# Altium schematic sheet [02] - SIM.SchDoc: =ProjectName
size A4; CheckedBy: DatNB; Author: Ven; CompanyName: Nacentech; Organization: IMET
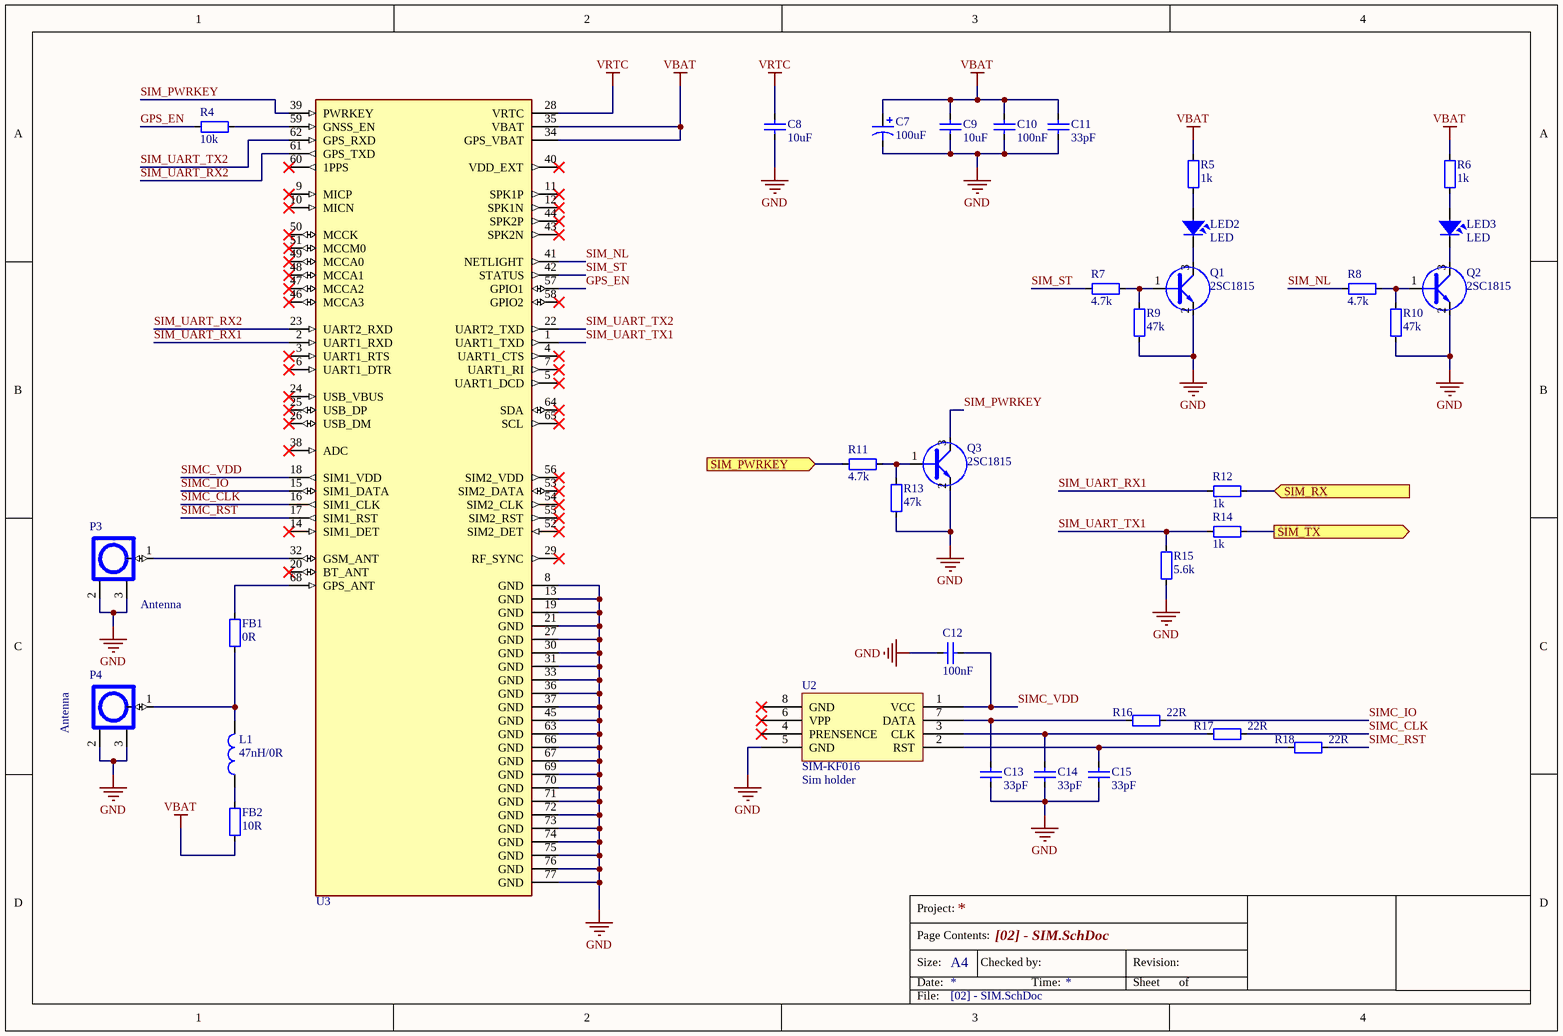
[diagram p0: [02] - SIM.SchDoc]

## Parts
C7  100uF  [CAP_7343]
C8  10uF  [CAP_0603]
C9  10uF  [CAP_0603]
C10  100nF  [CAP_0603]
C11  33pF  [CAP_0603]
C12  100nF  [CAP_0603]
C13  33pF  [CAP_0603]
C14  33pF  [CAP_0603]
C15  33pF  [CAP_0603]
FB1  0R  [RES-SMD-0805]
FB2  10R  [RES-SMD-0805]
L1  47nH/0R  [L-0805]
LED2  LED  [LED-0805-Yellow]
LED3  LED  [LED-1206-Blue]
P3  Antenna  [IPXS]
P4  Antenna  [IPXS]
Q1  2SC1815  [SOT23D]
Q2  2SC1815  [SOT23D]
Q3  2SC1815  [SOT23D]
R4  10k  [RES-SMD-0603]
R5  1k  [RES-SMD-0603]
R6  1k  [RES-SMD-0603]
R7  4.7k  [RES-SMD-0603]
R8  4.7k  [RES-SMD-0603]
R9  47k  [RES-SMD-0603]
R10  47k  [RES-SMD-0603]
R11  4.7k  [RES-SMD-0603]
R12  1k  [RES-SMD-0603]
R13  47k  [RES-SMD-0603]
R14  1k  [RES-SMD-0603]
R15  5.6k  [RES-SMD-0603]
R16  22R  [RES-SMD-0603]
R17  22R  [RES-SMD-0603]
R18  22R  [RES-SMD-0603]
U2  SIM-KF016  value Sim holder  [Sim Socket]
U3  SIM868  [SIM868]  (value not drawn)

## Ports
SIM_PWRKEY (in), SIM_RX (in), SIM_TX (out)

## Nets
GND: C7.2 C8.1 C9.1 C10.1 C11.1 C12.2 C13.1 C14.1 C15.1 P3.2 P3.3 P4.2 P4.3 Q1.2(E) Q2.2(E) Q3.2(E) R9.1 R10.1 R13.1 R15.2 U2.5(GND) U3.8(GND) U3.13(GND) U3.19(GND) U3.21(GND) U3.27(GND) U3.30(GND) U3.31(GND) U3.33(GND) U3.36(GND) U3.37(GND) U3.45(GND) U3.63(GND) U3.66(GND) U3.67(GND) U3.69(GND) U3.70(GND) U3.71(GND) U3.72(GND) U3.73(GND) U3.74(GND) U3.75(GND) U3.76(GND) U3.77(GND)
VBAT: C7.1 C9.2 C10.2 C11.2 FB2.1 R5.2 R6.2 U3.34(GPS_VBAT) U3.35(VBAT)
VRTC: C8.2 U3.28(VRTC)
GPS_EN: R4.1 U3.57(GPIO1)
SIM_NL: R8.1 U3.41(NETLIGHT)
SIM_PWRKEY: Q3.3(C) U3.39(PWRKEY)
SIM_PWRKEY: R11.1 ; port SIM_PWRKEY  [a separate net that carries the same name]
SIM_RX: R12.1 ; port SIM_RX
SIM_ST: R7.1 U3.42(STATUS)
SIM_TX: R14.1 ; port SIM_TX
SIM_UART_RX1: R12.2 U3.2(UART1_RXD)
SIM_UART_RX2: U3.23(UART2_RXD) U3.61(GPS_TXD)
SIM_UART_TX1: R14.2 R15.1 U3.1(UART1_TXD)
SIM_UART_TX2: U3.22(UART2_TXD) U3.62(GPS_RXD)
SIMC_CLK: R17.1 U3.16(SIM1_CLK)
SIMC_IO: R16.1 U3.15(SIM1_DATA)
SIMC_RST: R18.1 U3.17(SIM1_RST)
SIMC_VDD: C12.1 U2.1(VCC) U3.18(SIM1_VDD)
NetC13_2: C13.2 R16.2 U2.7(DATA)
NetC14_2: C14.2 R17.2 U2.3(CLK)
NetC15_2: C15.2 R18.2 U2.2(RST)
NetFB1_1: FB1.1 L1.2 P4.1
NetFB1_2: FB1.2 U3.68(GPS_ANT)
NetFB2_2: FB2.2 L1.1
NetLED2_1: LED2.1 R5.1
NetLED2_2: LED2.2 Q1.3(C)
NetLED3_1: LED3.1 R6.1
NetLED3_2: LED3.2 Q2.3(C)
NetP3_1: P3.1 U3.32(GSM_ANT)
NetQ1_1: Q1.1(B) R7.2 R9.2
NetQ2_1: Q2.1(B) R8.2 R10.2
NetQ3_1: Q3.1(B) R11.2 R13.2
NetR4_2: R4.2 U3.59(GNSS_EN)

Not connected (* = marked no-connect by the designer): U2 4(PRENSENCE)* 6(VPP)* 8(GND)*; U3 3(UART1_RTS)* 4(UART1_CTS)* 5(UART1_DCD)* 6(UART1_DTR)* 7(UART1_RI)* 9(MICP)* 10(MICN)* 11(SPK1P)* 12(SPK1N)* 14(SIM1_DET)* 20(BT_ANT)* 24(USB_VBUS)* 25(USB_DP)* 26(USB_DM)* 29(RF_SYNC)* 38(ADC)* 40(VDD_EXT)* 43(SPK2N)* 44(SPK2P)* 46(MCCA3)* 47(MCCA2)* 48(MCCA1)* 49(MCCA0)* 50(MCCK)* 51(MCCM0)* 52(SIM2_DET)* 53(SIM2_DATA)* 54(SIM2_CLK)* 55(SIM2_RST)* 56(SIM2_VDD)* 58(GPIO2)* 60(1PPS)* 64(SDA)* 65(SCL)*

## Notes on the sheet
- Project:
- Page Contents:
- Size:
- Date:
- A4
- Checked by:
- Time:
- Revision:
- Sheet
- of
- File:

## Library data of the parts
C7 = Cap Pol: Tantalum; Published: 8-Jun-2000; LatestRevisionDate: 17-Jul-2002; LatestRevisionNote: Re-released for DXP Platform.; PackageReference: POLAR0.8; Publisher: Altium Limited
C8-C15 = CapSMD: Capacitor; Value: 33p; Published: 8-Jun-2000; LatestRevisionDate: 17-Jul-2002; LatestRevisionNote: Re-released for DXP Platform.; PackageReference: RAD-0.3; Publisher: Altium Limited
FB1 FB2 = Resistor - SMD: Ferrit Bead; Manufacturer: Generic Components; Class: Passive; Published: 08/06/2000; Publisher: Altium Hobart Technology Centre
L1 = Inductor: Value: 150 mH
LED2 LED3 = LED: LED Single colour Green and Red; Value: LED 3 ly Single Colour
P3 P4 = IPXSx66: Antenna GSM GPS
Q1-Q3 = 2SC1815: NPN 600mW, ECB; Value: C1815
R4-R18 = Resistor - SMD: Resistor; Manufacturer: Generic Components; Class: Passive; Published: 08/06/2000; Publisher: Altium Hobart Technology Centre
U2 = Sim holder: SIM Card Holder KF-016
U3 = SIM868: SIM868 SIMCOM